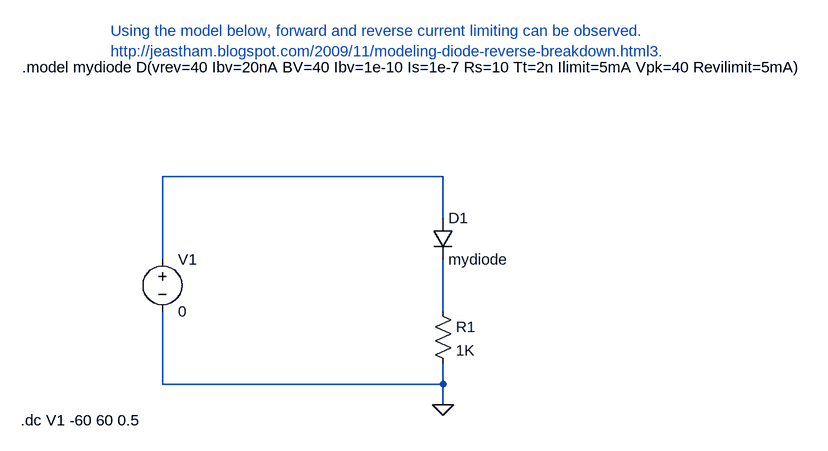
[diagram p0: schematic diode_breakdown.asc]
diode_breakdown.asc, the LTspice schematic file:
Version 4
SHEET 1 1040 680
WIRE 336 240 -96 240
WIRE 336 304 336 240
WIRE -96 368 -96 240
WIRE 336 448 336 368
WIRE -96 560 -96 448
WIRE 336 560 336 528
WIRE 336 560 -96 560
WIRE 336 592 336 560
FLAG 336 592 0
SYMBOL res 320 432 R0
SYMATTR InstName R1
SYMATTR Value 1K
SYMBOL voltage -96 352 R0
WINDOW 123 0 0 Left 0
WINDOW 39 0 0 Left 0
SYMATTR InstName V1
SYMATTR Value 0
SYMBOL diode 320 304 R0
SYMATTR InstName D1
SYMATTR Value mydiode
TEXT -176 16 Left 2 ;Using the model below, forward and reverse current limiting can be observed.\nhttp://jeastham.blogspot.com/2009/11/modeling-diode-reverse-breakdown.html3.
TEXT -312 72 Left 2 !.model mydiode D(vrev=40 Ibv=20nA BV=40 Ibv=1e-10 Is=1e-7 Rs=10 Tt=2n Ilimit=5mA Vpk=40 Revilimit=5mA)
TEXT -314 616 Left 2 !.dc V1 -60 60 0.5

The netlist it stands for:
* diode_breakdown.asc
R1 N002 0 1K
V1 N001 0 0
D1 N001 N002 mydiode
.model D D
.lib standard.dio
* Using the model below, forward and reverse current limiting can be observed.
* http://jeastham.blogspot.com/2009/11/modeling-diode-reverse-breakdown.html3.
.model mydiode D(vrev=40 Ibv=20nA BV=40 Ibv=1e-10 Is=1e-7 Rs=10 Tt=2n Ilimit=5mA Vpk=40 Revilimit=5mA)
.dc V1 -60 60 0.5
.backanno
.end